# EAGLE design base (1) (EAGLE 8.6.1)
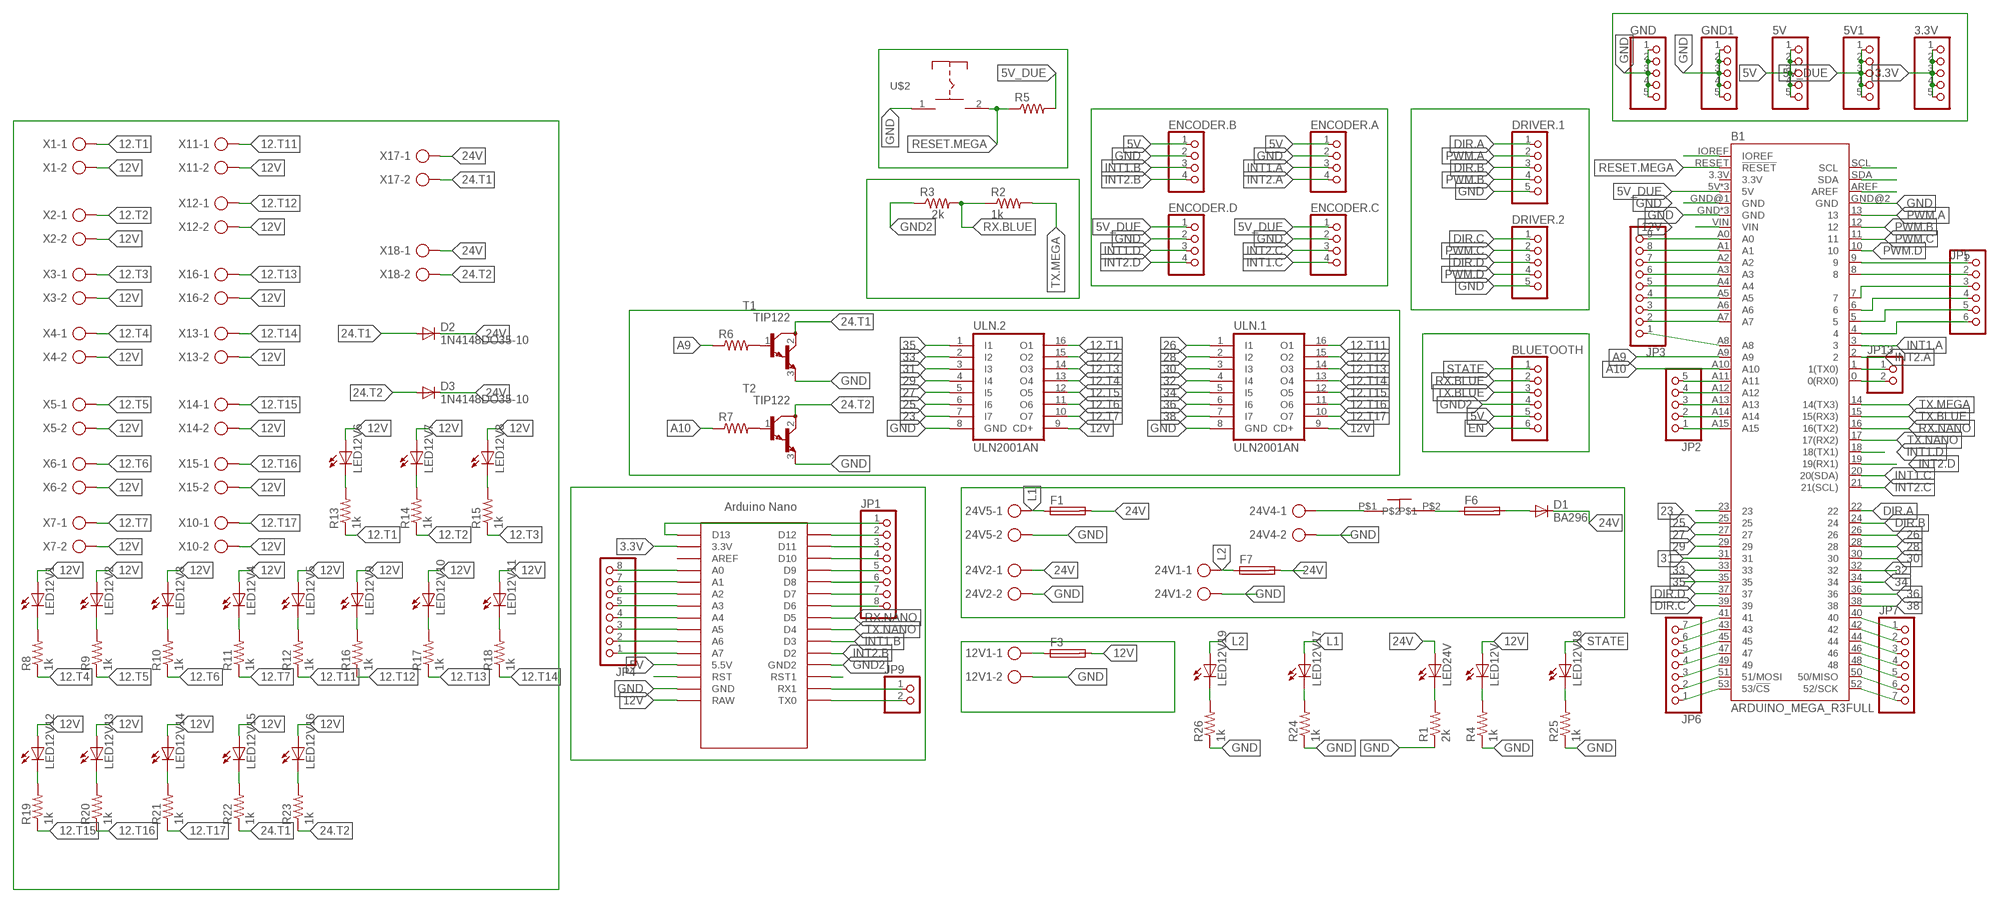
[diagram p0: schematic, sheet 1]

## Parts
3.3V  PINHD-1X5  [1X05]
5V  PINHD-1X5  [1X05]
5V1  PINHD-1X5  [1X05]
12V1  AK300/2  [AK300/2]
24V1  AK300/2  [AK300/2]
24V2  AK300/2  [AK300/2]
24V4  W237-113  [W237-113]
24V5  AK300/2  [AK300/2]
B1  ARDUINO_MEGA_R3FULL  [ARDUINO_MEGA_NO_SILK]
BLUETOOTH  PINHD-1X6  [1X06]
D1  BA296  [P2-15]
D2  1N4148DO35-10  [DO35-10]
D3  1N4148DO35-10  [DO35-10]
DRIVER.1  PINHD-1X5  [1X05]
DRIVER.2  PINHD-1X5  [1X05]
ENCODER.A  PINHD-1X4  [1X04]
ENCODER.B  PINHD-1X4  [1X04]
ENCODER.C  PINHD-1X4  [1X04]
ENCODER.D  PINHD-1X4  [1X04]
F1  SH22,5A  [SH22,5A]
F3  SH22,5A  [SH22,5A]
F6  SH22,5A  [SH22,5A]
F7  SH22,5A  [SH22,5A]
GND  PINHD-1X5  [1X05]
GND1  PINHD-1X5  [1X05]
JP1  PINHD-1X8  [1X08]
JP2  PINHD-1X5  [1X05]
JP3  PINHD-1X9  [1X09]
JP4  PINHD-1X8  [1X08]
JP5  PINHD-1X6  [1X06]
JP6  PINHD-1X7  [1X07]
JP7  PINHD-1X7  [1X07]
JP9  PINHD-1X2  [1X02]
JP13  PINHD-1X2  [1X02]
LED12V  LED5MM  [LED5MM]
LED12V1  LED3MM  [LED3MM]
LED12V2  LED3MM  [LED3MM]
LED12V3  LED3MM  [LED3MM]
LED12V4  LED3MM  [LED3MM]
LED12V5  LED3MM  [LED3MM]
LED12V6  LED3MM  [LED3MM]
LED12V7  LED3MM  [LED3MM]
LED12V8  LED3MM  [LED3MM]
LED12V9  LED3MM  [LED3MM]
LED12V10  LED3MM  [LED3MM]
LED12V11  LED3MM  [LED3MM]
LED12V12  LED3MM  [LED3MM]
LED12V13  LED3MM  [LED3MM]
LED12V14  LED3MM  [LED3MM]
LED12V15  LED3MM  [LED3MM]
LED12V16  LED3MM  [LED3MM]
LED12V17  LED3MM  [LED3MM]
LED12V18  LED3MM  [LED3MM]
LED12V19  LED3MM  [LED3MM]
LED24V  LED5MM  [LED5MM]
R1  2k  R-US_0207/10  [0207/10]
R2  1k  R-US_0204/7  [0204/7]
R3  2k  R-US_0207/10  [0207/10]
R4  1k  R-US_0207/10  [0207/10]
R5  R-US_0207/12  [0207/12]
R6  R-US_0204/5  [0204/5]
R7  R-US_0204/5  [0204/5]
R8  1k  R-US_0204/5  [0204/5]
R9  1k  R-US_0204/5  [0204/5]
R10  1k  R-US_0204/5  [0204/5]
R11  1k  R-US_0204/5  [0204/5]
R12  1k  R-US_0204/5  [0204/5]
R13  1k  R-US_0204/5  [0204/5]
R14  1k  R-US_0204/5  [0204/5]
R15  1k  R-US_0204/5  [0204/5]
R16  1k  R-US_0204/5  [0204/5]
R17  1k  R-US_0204/5  [0204/5]
R18  1k  R-US_0204/5  [0204/5]
R19  1k  R-US_0204/5  [0204/5]
R20  1k  R-US_0204/5  [0204/5]
R21  1k  R-US_0204/5  [0204/5]
R22  1k  R-US_0204/5  [0204/5]
R23  1k  R-US_0204/5  [0204/5]
R24  1k  R-US_0204/5  [0204/5]
R25  1k  R-US_0204/5  [0204/5]
R26  1k  R-US_0204/5  [0204/5]
T1  TIP122  [TO220]
T2  TIP122  [TO220]
U$1  NANO  [NANO]
U$2  PUSHBOTTON  [PUSHBOTTON]
U$3  ON_OFF  [ON_OFF]
ULN.1  ULN2001AN  [DIL16]
ULN.2  ULN2001AN  [DIL16]
X1  AK300/2  [AK300/2]
X2  AK300/2  [AK300/2]
X3  AK300/2  [AK300/2]
X4  AK300/2  [AK300/2]
X5  AK300/2  [AK300/2]
X6  AK300/2  [AK300/2]
X7  AK300/2  [AK300/2]
X10  AK300/2  [AK300/2]
X11  AK300/2  [AK300/2]
X12  AK300/2  [AK300/2]
X13  AK300/2  [AK300/2]
X14  AK300/2  [AK300/2]
X15  AK300/2  [AK300/2]
X16  AK300/2  [AK300/2]
X17  AK300/2  [AK300/2]
X18  AK300/2  [AK300/2]

## Nets
3.3V: 3.3V.1 3.3V.2 3.3V.3 3.3V.4 3.3V.5 U$1.3.3V
5V: 5V.1 5V.2 5V.3 5V.4 5V.5 BLUETOOTH.5 ENCODER.A.1 ENCODER.B.1 U$1.5V(5.5V)
5V_DUE: 5V1.1 5V1.2 5V1.3 5V1.4 5V1.5 B1.5V B1.5V@1(5V) B1.5V@2(5V) ENCODER.C.1 ENCODER.D.1 R5.2
12.T1: R13.1 ULN.2.16(O1) X1.1
12.T2: R14.1 ULN.2.15(O2) X2.1
12.T3: R15.1 ULN.2.14(O3) X3.1
12.T4: R8.1 ULN.2.13(O4) X4.1
12.T5: R9.1 ULN.2.12(O5) X5.1
12.T6: R10.1 ULN.2.11(O6) X6.1
12.T7: R11.1 ULN.2.10(O7) X7.1
12.T11: R12.1 ULN.1.16(O1) X11.1
12.T12: R16.1 ULN.1.15(O2) X12.1
12.T13: R17.1 ULN.1.14(O3) X16.1
12.T14: R18.1 ULN.1.13(O4) X13.1
12.T15: R19.1 ULN.1.12(O5) X14.1
12.T16: R20.1 ULN.1.11(O6) X15.1
12.T17: R21.1 ULN.1.10(O7) X10.1
12V: B1.VIN F3.2 LED12V1.A LED12V2.A LED12V3.A LED12V4.A LED12V5.A LED12V6.A LED12V7.A LED12V8.A LED12V9.A LED12V10.A LED12V11.A LED12V12.A LED12V13.A LED12V14.A LED12V15.A LED12V16.A LED12V.A U$1.RAW ULN.1.9(CD+) ULN.2.9(CD+) X1.2 X2.2 X3.2 X4.2 X5.2 X6.2 X7.2 X10.2 X11.2 X12.2 X13.2 X14.2 X15.2 X16.2
23: B1.23 ULN.2.7(I7)
24.T1: D2.A R22.1 T1.2(C) X17.2
24.T2: D3.A R23.1 T2.2(C) X18.2
24V: 24V2.1 D1.C D2.C D3.C F1.2 F7.2 LED24V.A X17.1 X18.1
25: B1.25 ULN.2.6(I6)
26: B1.26 ULN.1.1(I1)
27: B1.27 ULN.2.5(I5)
28: B1.28 ULN.1.2(I2)
29: B1.29 ULN.2.4(I4)
30: B1.30 ULN.1.3(I3)
31: B1.31 ULN.2.3(I3)
32: B1.32 ULN.1.4(I4)
33: B1.33 ULN.2.2(I2)
34: B1.34 ULN.1.5(I5)
35: B1.35 ULN.2.1(I1)
36: B1.36 ULN.1.6(I6)
38: B1.38 ULN.1.7(I7)
40: B1.40 JP7.1
A9: B1.A9 R6.1
A10: B1.A10 R7.1
DIR.A: B1.22 DRIVER.1.1
DIR.B: B1.24 DRIVER.1.3
DIR.C: B1.39 DRIVER.2.1
DIR.D: B1.37 DRIVER.2.3
EN: BLUETOOTH.6
GND: 12V1.2 24V1.2 24V2.2 24V4.2 24V5.2 B1.GND B1.GND@1(GND) B1.GND@2(GND) B1.GND@3(GND) B1.GND@4(GND) DRIVER.1.5 DRIVER.2.5 ENCODER.A.2 ENCODER.B.2 ENCODER.C.2 ENCODER.D.2 GND1.1 GND1.2 GND1.3 GND1.4 GND1.5 GND.1 GND.2 GND.3 GND.4 GND.5 R1.1 R4.1 R24.1 R25.1 R26.1 T1.3(E) T2.3(E) U$1.GND U$2.1 ULN.1.8(GND) ULN.2.8(GND)
GND2: BLUETOOTH.4 R3.1 U$1.GND1(GND2)
INT1.A: B1.3 ENCODER.A.3
INT1.B: ENCODER.B.3 U$1.D3
INT1.C: B1.20(20(SDA)) ENCODER.C.4
INT1.D: B1.18(18(TX1)) ENCODER.D.3
INT2.A: B1.2 ENCODER.A.4
INT2.B: ENCODER.B.4 U$1.D2
INT2.C: B1.21(21(SCL)) ENCODER.C.3
INT2.D: B1.19(19(RX1)) ENCODER.D.4
L1: 24V5.1 F1.1 LED12V17.A
L2: 24V1.1 F7.1 LED12V19.A
N$1: B1.SCL
N$2: B1.SDA
N$3: B1.AREF
N$7: 24V4.1 U$3.P$1
N$8: F6.1 U$3.P$2
N$9: B1.9 JP5.1
N$10: B1.8 JP5.2
N$11: B1.7 JP5.3
N$12: B1.6 JP5.4
N$13: B1.5 JP5.5
N$14: B1.4 JP5.6
N$16: LED12V1.K(C) R8.2
N$17: B1.1(1(TX0)) JP13.1
N$18: B1.0(0(RX0)) JP13.2
N$21: LED12V18.K(C) R25.2
N$22: LED12V19.K(C) R26.2
N$23: LED24V.K(C) R1.2
N$24: LED12V.K(C) R4.2
N$25: D1.A F6.2
N$27: LED12V2.K(C) R9.2
N$29: LED12V3.K(C) R10.2
N$30: LED12V4.K(C) R11.2
N$31: LED12V5.K(C) R12.2
N$32: LED12V6.K(C) R13.2
N$33: LED12V7.K(C) R14.2
N$34: LED12V8.K(C) R15.2
N$35: LED12V9.K(C) R16.2
N$36: LED12V10.K(C) R17.2
N$37: B1.42 JP7.2
N$38: B1.44 JP7.3
N$39: B1.46 JP7.4
N$40: B1.48 JP7.5
N$41: B1.50(50/MISO) JP7.6
N$42: B1.52(52/SCK) JP7.7
N$43: B1.IOREF
N$44: LED12V11.K(C) R18.2
N$46: LED12V12.K(C) R19.2
N$47: B1.A15 JP2.1
N$48: B1.A14 JP2.2
N$49: B1.A13 JP2.3
N$50: B1.A0 JP3.9
N$51: B1.A1 JP3.8
N$52: B1.A2 JP3.7
N$53: B1.A3 JP3.6
N$54: B1.A4 JP3.5
N$55: B1.A5 JP3.4
N$56: B1.A6 JP3.3
N$57: B1.A7 JP3.2
N$58: B1.A8 JP3.1
N$59: B1.A12 JP2.4
N$60: B1.A11 JP2.5
N$61: LED12V13.K(C) R20.2
N$62: LED12V14.K(C) R21.2
N$63: LED12V15.K(C) R22.2
N$64: LED12V16.K(C) R23.2
N$65: LED12V17.K(C) R24.2
N$75: B1.41 JP6.7
N$76: B1.45 JP6.5
N$77: B1.43 JP6.6
N$78: B1.47 JP6.4
N$79: B1.49 JP6.3
N$80: B1.51(51/MOSI) JP6.2
N$81: B1.53(53/!CS) JP6.1
N$102: R6.2 T1.1(B)
N$103: R7.2 T2.1(B)
N$107: JP1.1 U$1.D13
N$110: JP4.8 U$1.A0
N$111: JP4.7 U$1.A1
N$112: JP4.6 U$1.A2
N$113: JP4.5 U$1.A3
N$114: JP4.4 U$1.A4
N$115: JP4.3 U$1.A5
N$116: JP4.2 U$1.A6
N$117: JP4.1 U$1.A7
N$119: U$1.RST
N$122: JP1.2 U$1.D12
N$123: JP1.3 U$1.D11
N$124: JP1.4 U$1.D10
N$125: JP1.5 U$1.D9
N$126: JP1.6 U$1.D8
N$127: JP1.7 U$1.D7
N$128: JP1.8 U$1.D6
N$134: U$1.RST1
N$135: JP9.1 U$1.RX1
N$136: JP9.2 U$1.TX0
N$152: 12V1.1 F3.1
PWM.A: B1.13 DRIVER.1.2
PWM.B: B1.12 DRIVER.1.4
PWM.C: B1.11 DRIVER.2.2
PWM.D: B1.10 DRIVER.2.4
RESET.MEGA: B1.RESET(!RESET) R5.1 U$2.2
RX.BLUE: BLUETOOTH.2 R2.1 R3.2
RX.NANO: B1.16(16(TX2)) U$1.D5
STATE: BLUETOOTH.1 LED12V18.A
TX.BLUE: B1.15(15(RX3)) BLUETOOTH.3
TX.MEGA: B1.14(14(TX3)) R2.2
TX.NANO: B1.17(17(RX2)) U$1.D4
Unconnected: B1.3.3V U$1.AREF

## Library data of the parts
3.3V 5V 5V1 DRIVER.1 DRIVER.2 GND GND1 JP2 = pinhead:PINHD-1X5: PIN HEADER
12V1 24V1 24V2 24V5 X1-X7 X10-X18 = con-ptr500:AK300/2: CONNECTOR; OC_FARNELL: unknown; OC_NEWARK: unknown
24V4 = con-wago-500:W237-113: WAGO SCREW CLAMP; OC_FARNELL: unknown; OC_NEWARK: unknown
B1 = SparkFun-Boards:ARDUINO_MEGA_R3: Arduino Mega R3 ATmega2560 R3 compatible footprint. SparkFun Products: Arduino Mega 2560 R3 <https://www.sparkfun.com/products/11061>
BLUETOOTH JP5 = pinhead:PINHD-1X6: PIN HEADER
D1 = diode:BA296: DIODE
D2 D3 = diode:1N4148: DIODE high speed (Philips)
ENCODER.A ENCODER.B ENCODER.C ENCODER.D = pinhead:PINHD-1X4: PIN HEADER
F1 F3 F6 F7 = fuse:SH22,5A: FUSE HOLDER grid 22,5mm, isolated cap OGN0031 8201, Schurter (Buerklin); MPN: 0031.7701.11; OC_FARNELL: unknown; OC_NEWARK: 04F1224
JP1 JP4 = pinhead:PINHD-1X8: PIN HEADER
JP3 = pinhead:PINHD-1X9: PIN HEADER
JP6 JP7 = pinhead:PINHD-1X7: PIN HEADER
JP9 JP13 = pinhead:PINHD-1X2: PIN HEADER
LED12V LED12V1-LED12V19 LED24V = led:LED: LED OSRAM: - CHIPLED LG R971, LG N971, LY N971, LG Q971, LY Q971, LO R971, LY R971 LH N974, LH R974 LS Q976, LO Q976, LY Q976 LO Q996 - Hyper CHIPLED LW Q18S LB Q993, LB Q99A, LB R99A - SideLED LS A670, LO A670, LY A670, LG A670, LP A670 LB A673, LV A673, LT A673, LW A673 LH A674 LY A675 LS A676, LA A676, LO A676, LY A676, LW A676 LS A679, LY A679, LG A679 - Hyper Micro SIDELED® LS Y876, LA Y876, LO Y876, LY Y876 LT Y87S - SmartLED LW L88C, LW L88S LB L89C, LB L89S, LG L890 LS L89K, LO L89K, LY L89K LS L896, LA L896, LO L896, LY L896 - TOPLED LS T670, LO T670, LY T670, LG T670, LP T670 LSG T670, LSP T670, LSY T670, LOP T670, LYG T670 LG T671, LOG T671, LSG T671 LB T673, LV T673, LT T673, LW T673 LH T674 LS T676, LA T676, LO T676, LY T676, LB T676, LH T676, LSB T676, LW T676 LB T67C, LV T67C, LT T67C, LS T67K, LO T67K, LY T67K, LW E67C LS E67B, LA E67B, LO E67B, LY E67B, LB E67C, LV E67C, LT E67C LW T67C LS T679, LY T679, LG T679 LS T770, LO T770, LY T770, LG T770, LP T770 LB T773, LV T773, LT T773, LW T773 LH T774 LS E675, LA E675, LY E675, LS T675 LS T776, LA T776, LO T776, LY T776, LB T776 LHGB T686 LT T68C, LB T68C - Hyper Mini TOPLED® LB M676 - Mini TOPLED Santana® LG M470 LS M47K, LO M47K, LY M47K Source: http://www.osram.convergy.de LUXEON: - LUMILED® LXK2-PW12-R00, LXK2-PW12-S00, LXK2-PW14-U00, LXK2-PW14-V00 LXK2-PM12-R00, LXK2-PM12-S00, LXK2-PM14-U00 LXK2-PE12-Q00, LXK2-PE12-R00, LXK2-PE12-S00, LXK2-PE14-T00, LXK2-PE14-U00 LXK2-PB12-K00, LXK2-PB12-L00, LXK2-PB12-M00, LXK2-PB14-N00, LXK2-PB14-P00, LXK2-PB14-Q00 LXK2-PR12-L00, LXK2-PR12-M00, LXK2-PR14-Q00, LXK2-PR14-R00 LXK2-PD12-Q00, LXK2-PD12-R00, LXK2-PD12-S00 LXK2-PH12-R00, LXK2-PH12-S00 LXK2-PL12-P00, LXK2-PL12-Q00, LXK2-PL12-R00 Source: www.luxeon.com KINGBRIGHT: KA-3528ASYC Source: www.kingbright.com
R1-R26 = rcl:R-US_: RESISTOR, American symbol; SPICEPREFIX: R
T1 T2 = transistor:TIP122: NPN BIPOLAR DARLINGTON TRANSISTOR
U$1 = Arduino-clone:NANO: Arduino Nano
U$2 = push botton:PUSHBOTTON
U$3 = ON_OFF:ON_OFF
ULN.1 ULN.2 = uln-udn:ULN2001A: DRIVER ARRAY

## Board
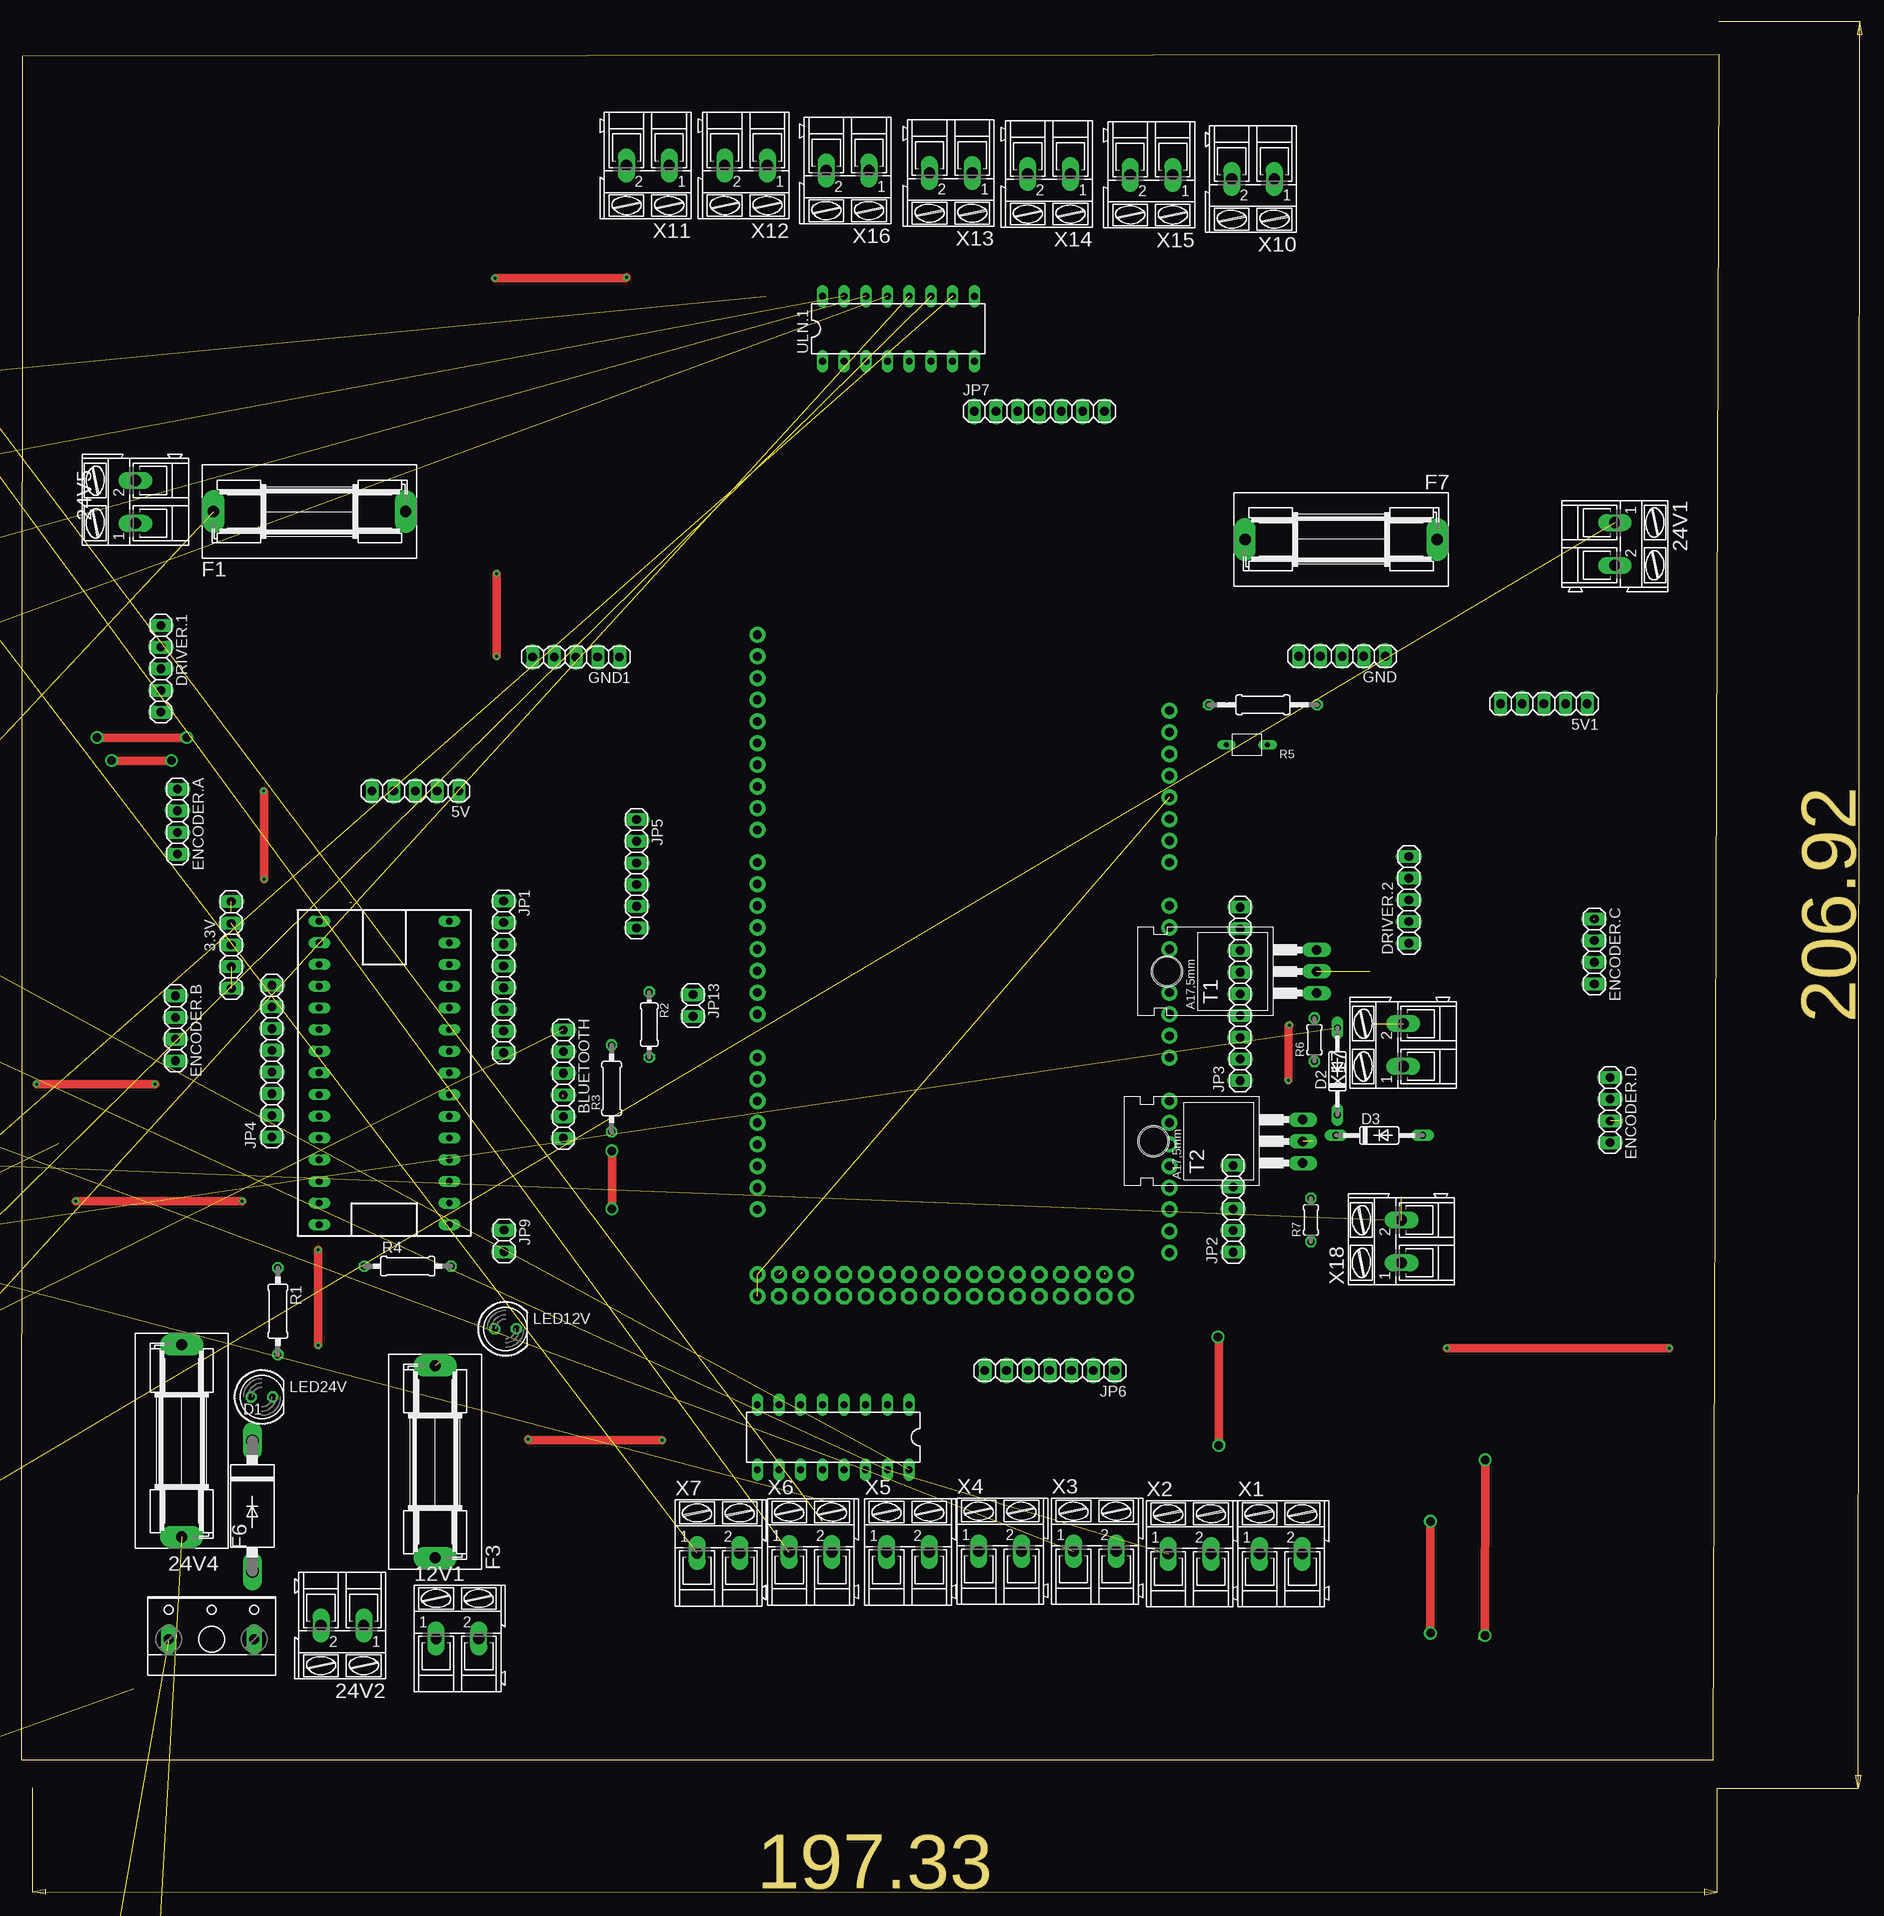
[diagram p1: board, top side]
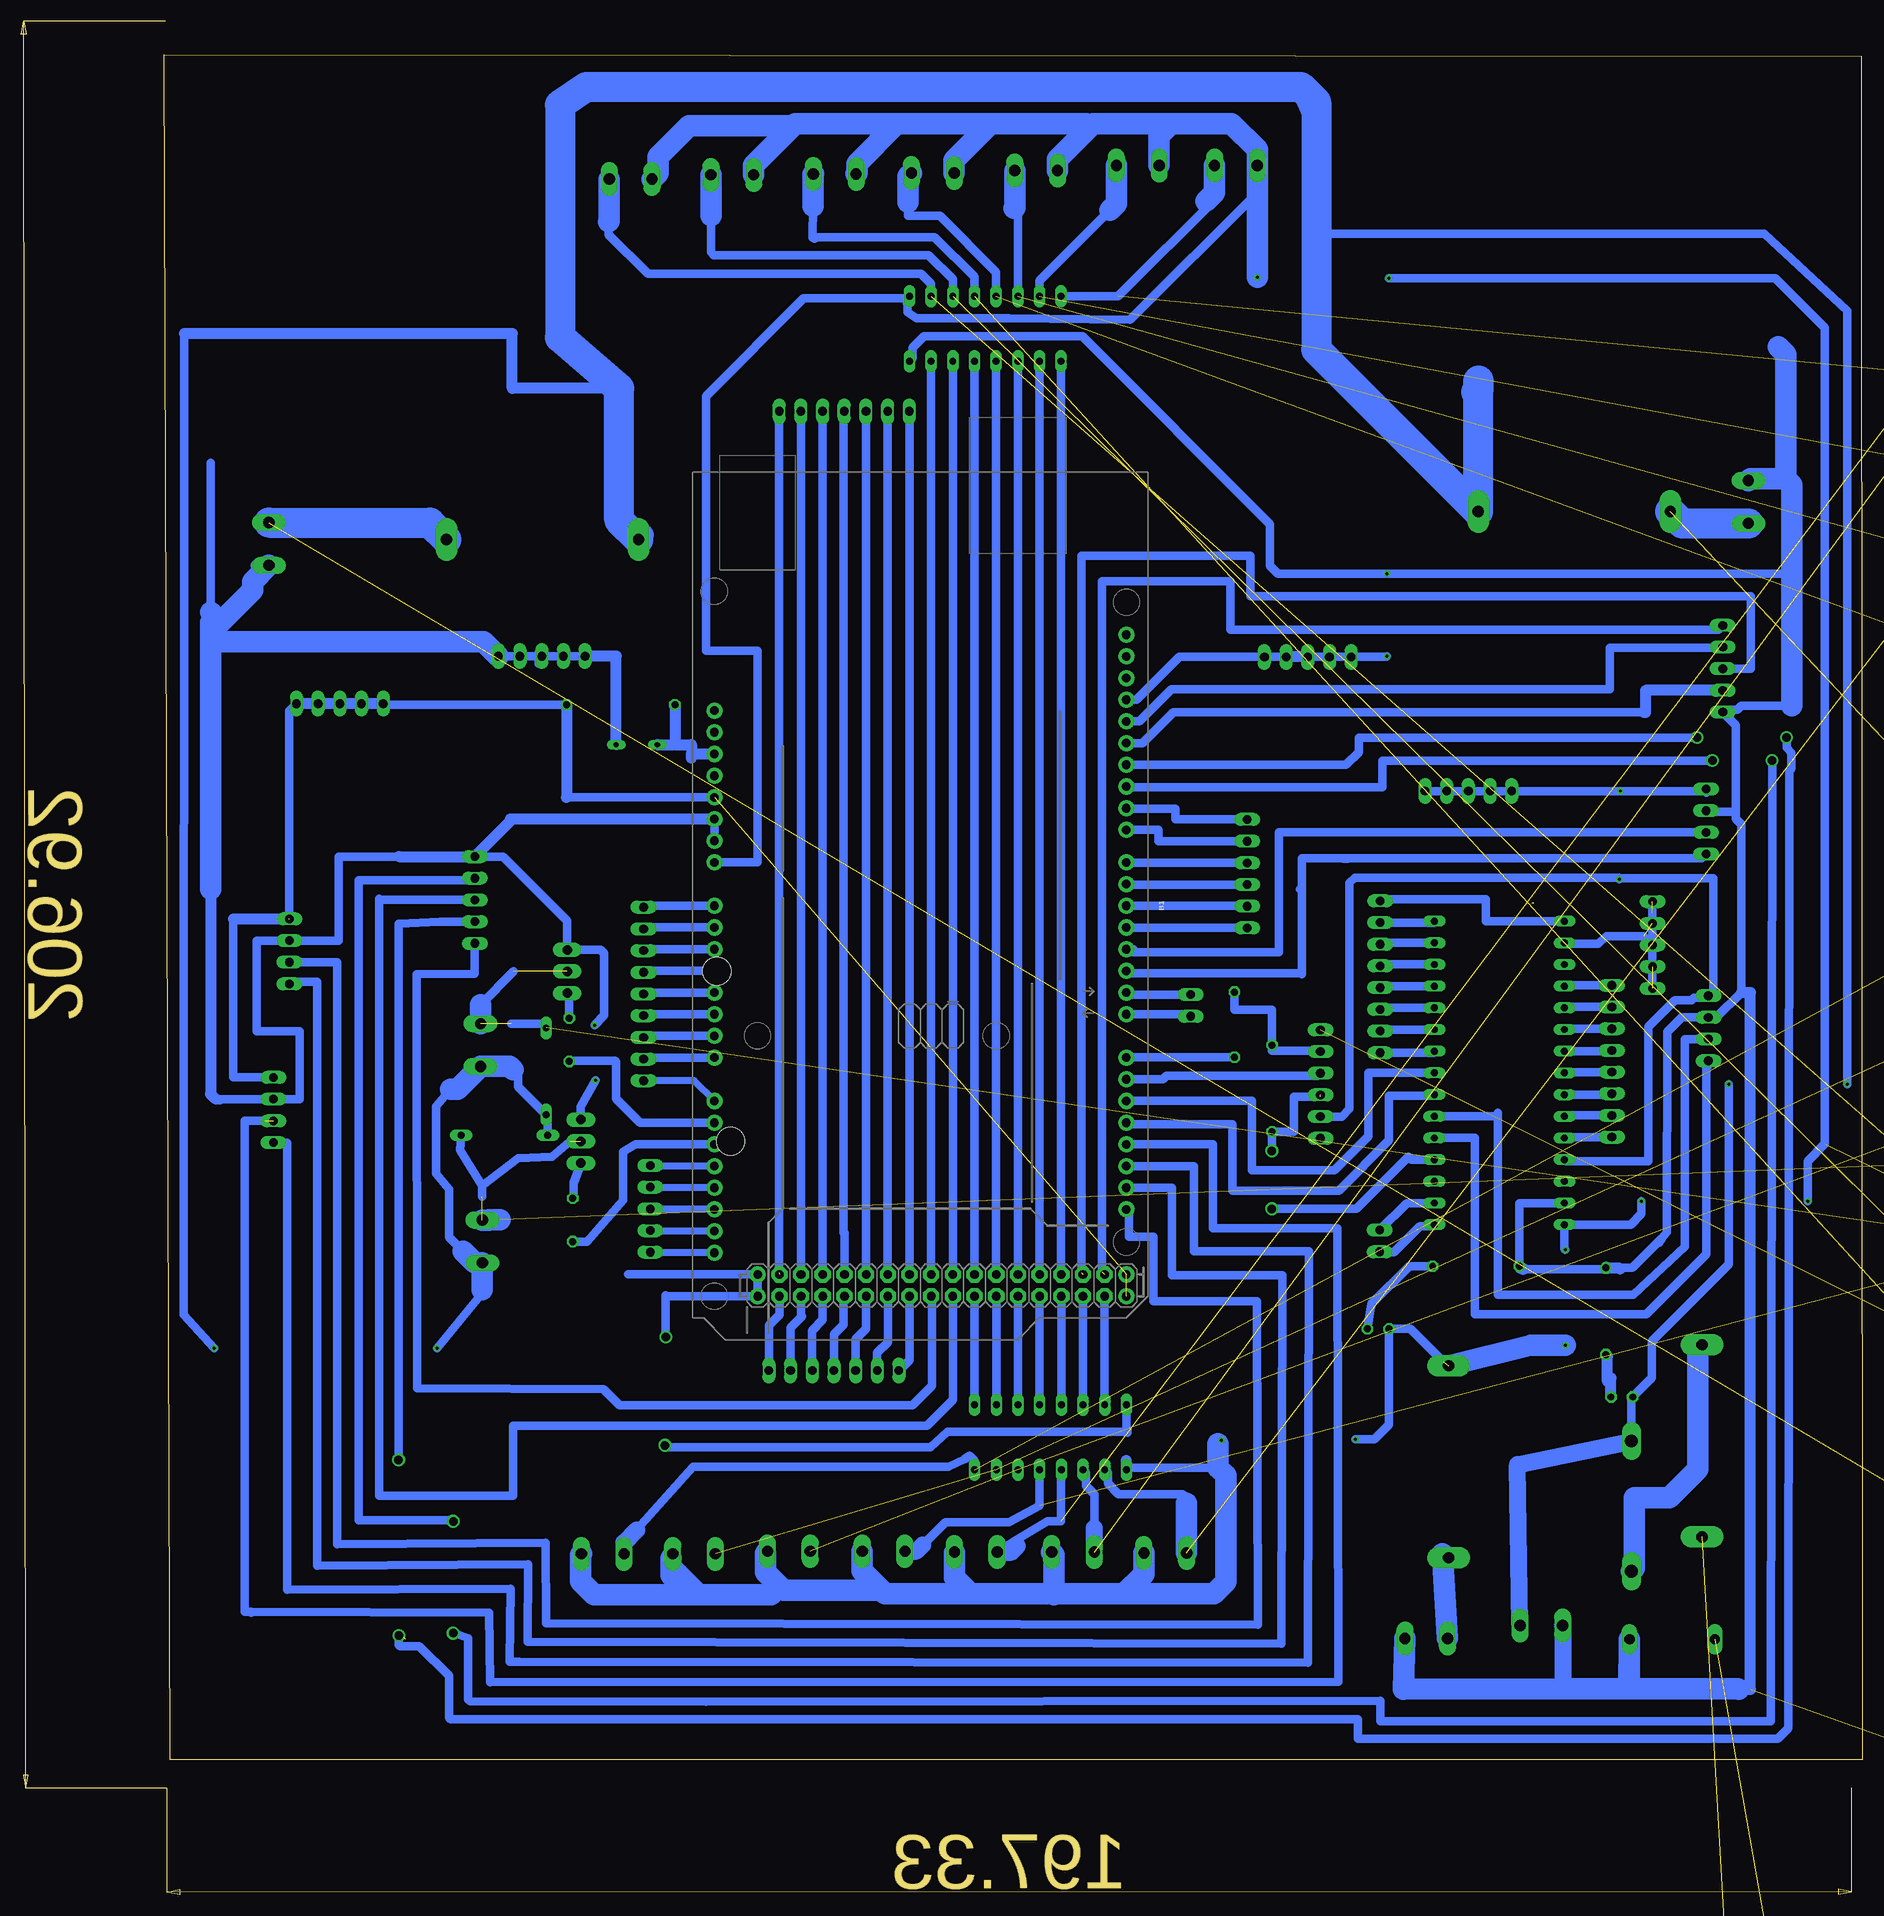
[diagram p2: board, bottom side, seen from below]

Size 198.94 x 199.72 mm. Coordinates in mm from the lower left corner, seen from the top.
Outline: 0,0.02 198.23,0 198.94,199.72 0.11,199.51 0,0.02
Copper layers (1*16): Top 0.035mm / dielectric 1.5mm / Bottom 0.035mm
Design rules "default *": minimum track width 6mil, minimum drill 0.35mm, track to track 40mil, track to pad 40mil, pad to pad 6mil, via to via 6mil, smd to smd 6mil, copper to edge 40mil, drill to drill 6mil, minimum pad ring 10mil, minimum via ring 8mil, stop-mask expansion 4mil, vias tented up to drill 0mil, thermal gap 10mil

### Footprints (pad centres in the part's own frame; a part is rotated, then mirrored left to right if it is on the bottom)
1X05 = drill 1.016 long: 1 -5.08,0; 2 -2.54,0; 3 0,0; 4 2.54,0; 5 5.08,0
AK300/2 = drill 1.321 long: 1 -2.515,0; 2 2.489,0
W237-113 = drill 1.194 long: 1 -5,-1.27; 2 5,-1.27
ARDUINO_MEGA_NO_SILK = drill 1.016 pad 1.88: 0 13.97,24.13; 1 11.43,24.13; 2 8.89,24.13; 3 6.35,24.13; 3.3V -13.97,-24.13; 4 3.81,24.13; 5 1.27,24.13; 5V -11.43,-24.13; 5V@1 44.45,24.13; 5V@2 46.99,24.13; 6 -1.27,24.13; 7 -3.81,24.13; 8 -7.62,24.13; 9 -10.16,24.13; 10 -12.7,24.13; 11 -15.24,24.13; 12 -17.78,24.13; 13 -20.32,24.13; 14 19.05,24.13; 15 21.59,24.13; 16 24.13,24.13; 17 26.67,24.13; 18 29.21,24.13; 19 31.75,24.13; 20 34.29,24.13; 21 36.83,24.13; A0 1.27,-24.13; A1 3.81,-24.13; A2 6.35,-24.13; A3 8.89,-24.13; A4 11.43,-24.13; A5 13.97,-24.13; A6 16.51,-24.13; A7 19.05,-24.13; A8 24.13,-24.13; A9 26.67,-24.13; A10 29.21,-24.13; A11 31.75,-24.13; A12 34.29,-24.13; A13 36.83,-24.13; A14 39.37,-24.13; A15 41.91,-24.13; AREF -25.4,24.13; GND -8.89,-24.13; GND@1 -6.35,-24.13; GND@2 44.45,-19.05; GND@3 46.99,-19.05; GND@4 -22.86,24.13; IOREF -19.05,-24.13; NC -21.59,-24.13; RESET -16.51,-24.13; SCL -30.48,24.13; SDA -27.94,24.13; VIN -3.81,-24.13 | drill 1.016 pad 1.88 octagon: 22 44.45,21.59; 23 46.99,21.59; 24 44.45,19.05; 25 46.99,19.05; 26 44.45,16.51; 27 46.99,16.51; 28 44.45,13.97; 29 46.99,13.97; 30 44.45,11.43; 31 46.99,11.43; 32 44.45,8.89; 33 46.99,8.89; 34 44.45,6.35; 35 46.99,6.35; 36 44.45,3.81; 37 46.99,3.81; 38 44.45,1.27; 39 46.99,1.27; 40 44.45,-1.27; 41 46.99,-1.27; 42 44.45,-3.81; 43 46.99,-3.81; 44 44.45,-6.35; 45 46.99,-6.35; 46 44.45,-8.89; 47 46.99,-8.89; 48 44.45,-11.43; 49 46.99,-11.43; 50 44.45,-13.97; 51 46.99,-13.97; 52 44.45,-16.51; 53 46.99,-16.51
1X06 = drill 1.016 long: 1 -6.35,0; 2 -3.81,0; 3 -1.27,0; 4 1.27,0; 5 3.81,0; 6 6.35,0
P2-15 = drill 1.499 long: A 7.62,0; C -7.62,0
DO35-10 = drill 0.813 long: A 5.08,0; C -5.08,0
1X04 = drill 1.016 long: 1 -3.81,0; 2 -1.27,0; 3 1.27,0; 4 3.81,0
SH22,5A = drill 1.321 pad 2.54 long: 1 -11.252,0; 2 11.252,0
1X08 = drill 1.016 long: 1 -8.89,0; 2 -6.35,0; 3 -3.81,0; 4 -1.27,0; 5 1.27,0; 6 3.81,0; 7 6.35,0; 8 8.89,0
1X09 = drill 1.016 long: 1 -10.16,0; 2 -7.62,0; 3 -5.08,0; 4 -2.54,0; 5 0,0; 6 2.54,0; 7 5.08,0; 8 7.62,0; 9 10.16,0
1X07 = drill 1.016 long: 1 -7.62,0; 2 -5.08,0; 3 -2.54,0; 4 0,0; 5 2.54,0; 6 5.08,0; 7 7.62,0
1X02 = drill 1.016 long: 1 -1.27,0; 2 1.27,0
LED5MM = drill 0.813 octagon: A -1.27,0; K 1.27,0
LED3MM = drill 0.813 octagon: A -1.27,0; K 1.27,0
0207/10 = drill 0.813 octagon: 1 -5.08,0; 2 5.08,0
0204/7 = drill 0.813 octagon: 1 -3.81,0; 2 3.81,0
0207/12 = drill 0.813 octagon: 1 -6.35,0; 2 6.35,0
0204/5 = drill 0.813 octagon: 1 -2.54,0; 2 2.54,0
TO220 = drill 1.118 long: 1 -2.54,-6.35; 2 0,-6.35; 3 2.54,-6.35 | hole 3.302: 0,11.176
NANO = drill 0.8 long: 3.3V -10.16,24.13; 5V -10.16,-1.27; A0 -10.16,19.05; A1 -10.16,16.51; A2 -10.16,13.97; A3 -10.16,11.43; A4 -10.16,8.89; A5 -10.16,6.35; A6 -10.16,3.81; A7 -10.16,1.27; AREF -10.16,21.59; D2 5.08,1.27; D3 5.08,3.81; D4 5.08,6.35; D5 5.08,8.89; D6 5.08,11.43; D7 5.08,13.97; D8 5.08,16.51; D9 5.08,19.05; D10 5.08,21.59; D11 5.08,24.13; D12 5.08,26.67; D13 -10.16,26.67; GND -10.16,-6.35; GND1 5.08,-1.27; RAW -10.16,-8.89; RST -10.16,-3.81; RST1 5.08,-3.81; RX1 5.08,-6.35; TX0 5.08,-8.89
PUSHBOTTON = drill 0.6 long: 1 -12.43,5.08; 2 -7.62,5.08
ON_OFF = drill 1 pad 2.184 long: P$1 2,9; P$2 9.525,8.89
DIL16 = drill 0.813 long: 1 -8.89,-3.81; 2 -6.35,-3.81; 3 -3.81,-3.81; 4 -1.27,-3.81; 5 1.27,-3.81; 6 3.81,-3.81; 7 6.35,-3.81; 8 8.89,-3.81; 9 8.89,3.81; 10 6.35,3.81; 11 3.81,3.81; 12 1.27,3.81; 13 -1.27,3.81; 14 -3.81,3.81; 15 -6.35,3.81; 16 -8.89,3.81

### Placement (x,y rotation side)
3.3V  24.59,95.44 90 top
5V  46.16,113.48 180 top
5V1  178.36,123.7 180 top
12V1  51.1,14.22 0 top
24V1  186.67,142.39 270 top
24V2  37.59,15.74 180 top
24V4  22.28,15.41 0 top
24V5  13.36,147.34 90 top
B1  110.36,101.3 270 bottom
BLUETOOTH  63.49,79.15 270 top
D1  27.06,29.72 270 top
D2  154.18,80.64 90 top
D3  159.08,73.14 0 top
DRIVER.1  16.36,127.8 270 top
DRIVER.2  162.54,100.72 90 top
ENCODER.A  18.3,109.9 270 top
ENCODER.B  18.05,85.69 270 top
ENCODER.C  184.27,94.69 270 top
ENCODER.D  186.12,76.12 270 top
F1  33.76,146.21 0 top
F3  48.48,34.93 90 top
F6  18.79,37.37 90 top
F7  154.62,142.94 180 top
GND  154.71,129.26 180 top
GND1  64.97,129.18 180 top
JP1  56.5,91.71 270 top
JP2  141.98,64.54 90 top
JP3  142.78,89.71 90 top
JP4  29.35,81.83 90 top
JP5  72.08,103.79 270 top
JP6  120.49,45.59 180 top
JP7  119.27,157.94 0 top
JP9  56.55,60.78 270 top
JP13  78.68,88.36 270 top
LED12V  56.72,50.49 0 top
LED12V1  -50.79,44.44 0 top  (outside the outline)
LED12V2  -69.49,235.14 0 top  (outside the outline)
LED12V3  -69.49,222.44 0 top  (outside the outline)
LED12V4  -69.49,209.74 0 top  (outside the outline)
LED12V5  -69.49,197.04 0 top  (outside the outline)
LED12V6  -69.49,82.74 0 top  (outside the outline)
LED12V7  -69.49,70.04 0 top  (outside the outline)
LED12V8  -66.79,56.84 0 top  (outside the outline)
LED12V9  -69.49,184.34 0 top  (outside the outline)
LED12V10  -69.49,171.64 0 top  (outside the outline)
LED12V11  -69.49,158.94 0 top  (outside the outline)
LED12V12  -69.49,146.24 0 top  (outside the outline)
LED12V13  -69.49,133.54 0 top  (outside the outline)
LED12V14  -69.49,120.84 0 top  (outside the outline)
LED12V15  -69.49,108.14 0 top  (outside the outline)
LED12V16  -69.49,95.44 0 top  (outside the outline)
LED12V17  -72.02,44.04 0 top  (outside the outline)
LED12V18  -72.02,17.44 0 top  (outside the outline)
LED12V19  -72.02,-9.16 0 top  (outside the outline)
LED24V  28.18,42.51 0 top
R1  30.05,52.55 270 top
R2  73.56,86.11 270 top
R3  69.15,78.64 90 top
R4  45.26,57.83 0 top
R5  145.45,123.58 0 top
R6  151.48,84.34 90 top
R7  151.08,63.24 90 top
R8  -37.96,65.84 0 top  (outside the outline)
R9  -31.56,197.84 0 top  (outside the outline)
R10  -30.88,185.44 0 bottom  (outside the outline)
R11  -31.56,172.44 0 top  (outside the outline)
R12  -31.56,159.74 0 top  (outside the outline)
R13  -31.56,108.94 0 top  (outside the outline)
R14  -31.56,96.24 0 top  (outside the outline)
R15  -31.56,83.54 0 top  (outside the outline)
R16  -31.56,147.04 0 top  (outside the outline)
R17  -31.56,134.34 0 top  (outside the outline)
R18  -31.56,121.64 0 top  (outside the outline)
R19  -31.56,20.04 0 top  (outside the outline)
R20  -31.56,32.74 0 top  (outside the outline)
R21  -31.56,45.44 0 top  (outside the outline)
R22  -31.56,58.14 0 top  (outside the outline)
R23  -31.56,70.84 0 top  (outside the outline)
R24  -70.72,30.74 0 top  (outside the outline)
R25  -70.72,4.14 0 top  (outside the outline)
R26  -70.72,-22.46 0 top  (outside the outline)
T1  145.38,92.34 90 top
T2  143.78,72.44 90 top
U$1  45.06,71.57 0 top
U$2  133.55,123.98 180 top
U$3  5.38,-51.26 0 top  (outside the outline)
ULN.1  102.75,167.62 0 top
ULN.2  95.11,37.79 180 top
X1  147.58,24.14 0 top
X2  136.88,24.14 0 top
X3  125.78,24.44 0 top
X4  114.68,24.44 0 top
X5  103.88,24.34 0 top
X6  92.48,24.34 0 top
X7  81.68,24.24 0 top
X10  144.28,185.14 180 top
X11  73.38,186.74 180 top
X12  84.88,186.74 180 top
X13  108.88,185.84 180 top
X14  120.38,185.74 180 top
X15  132.38,185.64 180 top
X16  96.78,186.14 180 top
X17  161.88,83.74 90 top
X18  161.68,60.74 90 top

### Tracks (layer width: path | path; a pad name or v marks a point on that pad's centre or on a via)
3.3V  (3 unrouted)
  Bottom 1.016: 24.59,99.25 3.3V.1 | 3.3V.3 25.62,96.47 30.01,96.47 30.91,95.57 34.77,95.57 U$1.3.3V | 3.3V.4 3.3V.5
5V  (via drill 0.35)
  Top 1.016: v28.48,103.14 28.48,113.38 v28.38,113.48
  Bottom 1: 18.3,113.25 ENCODER.A.1 | 63.49,75.32 BLUETOOTH.5
  Bottom 1.016: 5V.5 40.85,113.71 | 5V.5 5V.4 5V.3 5V.2 5V.1 | 5V.5 41.08,112.5 | U$1.5V 34.74,70.14 25.08,70.14 25.08,85.87 21.95,89 20.01,89 19.75,89.25 18.3,89.25 ENCODER.B.1 17.48,90.07 17.48,103.25 28.37,103.25 | 5V.5 v28.38,113.48 18.53,113.48 ENCODER.A.1 | 28.37,103.25 v28.48,103.14 | BLUETOOTH.5 60.98,75.34 60.08,76.24 60.08,102.74 59.48,103.34 28.47,103.34 28.37,103.25
5V_DUE  (3 unrouted)
  Bottom 1: 190.84,98.48 190.84,79.93 ENCODER.D.1
  Bottom 1.016: 151.8,112.73 B1.5V | R5.2 173.15,123.58 5V1.5 | ENCODER.C.1 184.27,122.88 5V1.1
  Bottom 1.27: 5V1.5 5V1.4 5V1.3 5V1.2 5V1.1 | R5.2 151.8,112.73 | 184.29,98.48 190.84,98.48
12.T1  (1 unrouted)
  Bottom 1.016: ULN.2.16 104,35.06 104.58,35.64 105.18,35.24 107.08,34.34 136.98,34.34 143.57,26.94
  Bottom 2: X1.1 145.06,25.44 143.57,26.94
12.T2  (2 unrouted)
12.T3  (2 unrouted)
12.T4  (1 unrouted)
  Bottom 1.016: ULN.2.13 96.38,29.74 99.97,27.85 107.41,27.85 110.09,25.16
  Bottom 2: X4.1 110.81,24.44 110.09,25.16
12.T5  (1 unrouted)
  Bottom 1: X5.1 99.28,25.64 95.48,27.94 93.88,27.94 93.88,33.94 ULN.2.12
  Bottom 2: X5.1 99.68,24.34 98.98,25.04
12.T6  (1 unrouted)
  Bottom 1.016: 89.96,27.14 89.96,31.11 90.94,32.08 90.94,33.63 ULN.2.11
  Bottom 2: X6.1 89.96,27.14
12.T7  (1 unrouted)
  Bottom 1.016: 79.16,30.04 79.16,30.63 79.67,31.14 87.12,31.14 88.4,32.42 88.4,33.63 ULN.2.10
  Bottom 2.5: X7.1 79.16,30.04
12.T11  (1 unrouted)
  Bottom 1.016: ULN.1.16 87.19,171.43 75.58,183.04 75.58,186.43 X11.1
  Bottom 2.5: X11.1 75.89,183.53 76.88,182.54
12.T12  (1 unrouted)
  Bottom 1.016: ULN.1.15 96.4,173.22 88.13,181.49 87.48,182.14 87.48,187.04 87.18,187.34 | 87.08,187.44 87.18,187.34 | 87.18,187.34 87.48,187.34 87.48,186.83 X12.1
  Bottom 2.5: X12.1 87.39,182.23 88.13,181.49
12.T13  (1 unrouted)
  Bottom 1.016: ULN.1.14 98.94,185.79 X16.1
  Bottom 2.5: X16.1 99.29,181.8 99.39,181.7
12.T14  (1 unrouted)
  Bottom 1.016: ULN.1.13 101.48,174.24 108.08,180.84 111.78,180.84 111.78,182.44 111.78,186.54 111.38,186.54 | 111.28,185.24 111.39,185.36 X13.1
  Bottom 2.5: X13.1 111.78,185.46 111.78,182.44
12.T15  (1 unrouted)
  Bottom 1.016: ULN.1.12 104.02,173.68 108.68,178.34 122.58,178.34 122.78,178.14 122.99,178.26 122.94,181.94
  Bottom 2.5: X14.1 122.94,185.69 122.94,181.94
12.T16  (1 unrouted)
  Bottom 1.016: ULN.1.11 106.56,173.42 109.38,176.24 134.58,176.24 134.89,176.56 134.89,180.84
  Bottom 2.5: X15.1 134.89,180.84
12.T17  (1 unrouted)
  Bottom 1.016: ULN.1.10 109.1,172.86 110.28,174.04 142.28,174.04 146.88,178.64 146.88,180.14
  Bottom 2.5: X10.1 146.79,180.23 146.88,180.14
12V  (via drill 0.35)  (17 unrouted)
  Top 1.016: v75.08,37.44 59.48,37.44 v59.38,37.54 | v34.78,48.54 v34.78,59.74 | v25.88,65.44 v6.38,65.44 | v55.48,173.54 70.78,173.54 v70.88,173.64
  Bottom 1: 49.08,46.64 52.92,50.49 LED12V.A 55.45,39.27 57.18,37.54
  Bottom 1.016: 111.91,171.16 ULN.1.9 | 111.91,171.16 124.03,171.16 135.46,159.73 135.46,129.88 129.41,129.88 129.41,105.11 B1.VIN | 86.48,19.44 94.58,19.44 | 94.58,19.44 94.68,19.34 94.97,19.63 X6.2 | 94.58,19.44 95.58,19.44 | 104.48,19.44 104.93,19.89 | 104.93,19.89 106.38,21.34 | 106.38,24.24 106.38,25.04 106.58,25.24 106.58,24.55 X5.2 | 104.93,19.89 114.93,19.89 | 114.93,19.89 116.83,21.79 | 114.93,19.89 125.73,19.89 | 125.73,19.89 128.48,22.64 128.48,24.23 X3.2 | 125.73,19.89 126.38,19.89 127.28,19.89 135.83,19.89 | 135.83,19.89 139.58,23.64 139.37,23.85 X2.2 | 135.83,19.89 149.13,19.89 150.18,20.94 | 73.89,191.64 81.48,191.64 81.48,191.14 | 90.13,191.6 90.88,191.6 | 102.13,191.6 113.73,191.6 | 113.73,191.6 X14.2 | 113.73,191.6 125.43,191.6 126.03,191.4 X15.2 | X11.2 70.89,183.53 85.78,168.64 99.98,168.84 110.78,168.84 111.88,169.52 111.91,171.16 | 75.48,34.24 85.96,34.24 ULN.2.9 | 75.48,37.04 v75.08,37.44 | 57.18,37.54 v59.38,37.54 | v34.78,59.74 34.9,59.87 U$1.RAW 27.14,62.68 25.88,63.94 v25.88,65.44 | v6.38,65.44 6.38,70.14 4.38,72.14 4.38,167.74 10.18,173.54 v55.48,173.54
  Bottom 1.27: ULN.2.9 86.22,35.04
  Bottom 2.5: F3.2 38.82,48.54 v34.78,48.54 | v70.88,173.64 70.88,186.73 X11.2 70.89,188.64 73.89,191.64 80.98,191.64 81.48,191.14 82.39,190.23 X12.2 | 81.48,191.64 81.52,191.6 90.13,191.6 94.29,187.44 X16.2 | 90.88,191.6 102.13,191.6 | 102.13,191.6 106.39,187.34 X13.2 | 102.13,191.6 113.12,191.6 | 113.12,191.6 117.78,186.94 117.78,185.85 X14.2 | 113.12,191.6 125.02,191.6 129.88,186.74 X15.2 | 126.03,191.4 137.42,191.4 141.08,187.74 141.08,185.85 X10.2 | X7.2 84.16,21.75 86.48,19.44 | 86.48,19.44 75.98,19.44 74.58,20.84 74.58,33.34 75.48,34.24 75.48,37.04 | 86.48,19.44 94.78,19.44 94.97,19.63 | 94.68,19.34 94.68,24.05 X6.2 | 95.58,19.44 104.48,19.44 | 104.48,19.44 106.38,21.34 106.38,24.24 | 104.48,19.44 114.48,19.44 116.83,21.79 117.16,22.13 X4.2 | 114.93,19.89 126.38,19.89 128.48,21.99 128.48,24.23 | 127.28,19.89 127.83,19.34 137.28,19.34 | 137.28,19.34 139.58,21.64 139.58,23.64 | 137.28,19.34 148.58,19.34 150.18,20.94 150.18,24.03 X1.2
23
  Bottom 1: B1.23 ULN.2.7
24.T1  (3 unrouted)
  Bottom 1.016: 161.88,88.44 157.98,92.34 | D2.A 154.69,86.23 158.28,86.23
  Bottom 2.5: X17.2 161.88,88.44
24.T2  (3 unrouted)
  Bottom 1.016: D3.A 164.26,71.42 161.68,67.24 | 161.68,65.94 161.68,67.24 | 161.68,67.24 157.48,70.44 153.48,70.64 151.38,72.44
  Bottom 2.5: X18.2 160.89,63.23 160.88,63.24 159.58,63.24
24V  (via drill 0.35)
  Top 1.016: v193.08,48.24 v166.98,48.24 | v15.68,79.14 v1.78,79.14
  Bottom 1.016: 196.58,167.04 196.68,52.14 v193.08,48.24 | D1.C 27.06,42.36 LED24V.A 24.68,44.75 24.68,49.04 15.68,58.04 v15.68,79.14 | v1.78,79.14 1.78,169.74 11.48,178.74 63.88,178.74 63.98,178.84 | D3.C 154,75.04 D2.C 157.48,78.86 157.48,80.84 158.08,80.84 | 163.93,59.59 165.58,61.24 165.58,66.84 167.08,68.64 167.08,76.54 165.38,78.54 | v166.98,48.24 161.68,54.64 161.68,55.04
  Bottom 1.27: 145.62,160.64 158.18,160.64 158.18,167.04 196.58,167.04
  Bottom 2: 24V2.1 40.41,34.6 D1.C
  Bottom 2.5: 161.68,55.04 X18.1 162.56,58.23 163.93,59.59 | 158.08,80.84 158.46,81.23 X17.1 164.56,78.54 165.38,78.54
  Bottom 2.54: F7.2 142.82,143.48 | F1.2 45.25,146.45 45.25,160.2 | 63.98,165.18 63.98,178.84 63.98,191.84 65.78,195.94
  Bottom 3.5: F7.2 145.62,145.2 145.62,160.64 152.58,166.6 152.58,193.84 149.48,195.94 65.78,195.94 63.98,194.14 63.98,165.18 45.25,146.45 | F1.2 45.01,161.51 44.98,161.54 44.98,160.48 45.25,160.2
25
  Bottom 1: B1.25 ULN.2.6
26
  Bottom 1: ULN.1.1 B1.26
27
  Bottom 1: B1.27 ULN.2.5
28
  Bottom 1: ULN.1.2 B1.28
29
  Bottom 1: 96.48,54.31 B1.29 ULN.2.4
30
  Bottom 1: ULN.1.3 B1.30
31
  Bottom 1: B1.31 ULN.2.3
32
  Bottom 1: ULN.1.4 B1.32
33
  Bottom 1: B1.33 ULN.2.2
34
  Bottom 1: ULN.1.5 B1.34
35
  Bottom 1: B1.35 ULN.2.1
36
  Bottom 1: ULN.1.6 B1.36
38
  Bottom 1: ULN.1.7 B1.38
40
  Bottom 1: JP7.1 111.65,56.85 B1.40
A9
  Bottom 1.016: B1.A9 143.21,74.63 146,77.43 146,81.75 146.13,81.88 151.4,81.88 R6.1
A10
  Bottom 1.016: B1.A10 143.73,72.09 145.18,71.24 145.18,65.54 149.42,60.7 R7.1
DIR.A  (1 unrouted)
  Bottom 1: DRIVER.1.1 16.86,132.38 74.03,132.38 74.03,138.04 89.07,138.04 89.07,57.15
DIR.B  (1 unrouted)
  Bottom 1: DRIVER.1.3 13.07,127.8 13.07,136.28 71.67,136.28 71.67,141.04 91.48,141.04 91.48,57.04
DIR.C
  Bottom 1: B1.39 108.98,54.2 108.98,43.84 111.28,41.54 145.18,41.54
  Bottom 1.016: 145.18,41.54 145.61,41.54 147.48,43.41 169.28,43.54 169.37,92.04 162.54,92.07 DRIVER.2.1
DIR.D
  Bottom 1: DRIVER.2.3 173.78,100.72 | 173.78,100.72 173.78,100.84 | 173.78,100.72 173.78,30.94 158.08,30.94 158.08,39.14 109.58,39.14 106.55,42.17 B1.37
GND  (via drill 0.35, 1)  (3 unrouted)
  Top 1.016: v148.41,79.59 148.41,85.94 v148.54,86.07 | v140.28,36.84 140.28,49.44 v140.18,49.54 | v55.68,129.24 v55.68,138.94
  Bottom 1: ENCODER.B.2 18.08,87 | ULN.2.8 86.22,38.74 86.08,38.74 86.08,38.34 86.68,38.44 107.18,38.44 109.18,36.64 | 192.89,77.39 192.89,77.24 192.38,77.24 192.38,77.39 ENCODER.D.2 183.08,77.39 183.08,85.34 188.08,85.34 188.08,95.96 ENCODER.C.2 | B1.GND@3 140.05,54.31 140.18,54.44 v140.18,49.54
  Bottom 1.016: U$1.GND 40.21,65.22 40.21,57.49 39.64,57.49 28.36,57.49 | 144.57,56.85 B1.GND@2 B1.GND@3 | B1.GND@4 85.01,124.16 79.99,129.18 GND1.1 GND1.2 67.51,128.16 | GND1.3 GND1.4 GND1.5 55.74,129.18 v55.68,129.24 | 14.84,111.04 14.84,121.2 DRIVER.1.5 16.75,122.72 16.88,122.84 16.75,122.97 14.65,122.97 14.18,123.44 8.28,123.44 | 14.84,111.04 14.84,110.22 14.18,109.56 14.18,89.88 17.09,86.96 ENCODER.B.2 21.14,86.96 22.84,85.26 22.94,61.82 23.47,61.09 | GND.5 GND.4 GND.3 | GND.3 155.06,129.26 | 155.06,128.38 155.06,129.26 | GND.3 154.71,129.65 155.06,129.65 155.06,129.26 | 155.06,129.26 GND.2 GND.1 | B1.GND B1.GND@1 | ENCODER.A.2 18.3,111.04 14.84,111.04 | ENCODER.C.2 178.48,95.96 178.48,105.8 171.43,105.8 | 8.28,138.94 v55.68,138.94 68.48,138.94 69.38,139.84 69.38,144.74 91.38,166.74 109.92,166.74 111.28,165.38 111.28,164.17 ULN.1.8 | 23.47,61.09 23.79,60.67 23.8,60.57 | 23.47,61.09 26.94,57.63 R1.1 | T2.3 150.13,76.48 v148.41,79.59 | v148.54,86.07 147.4,87.21 147.4,94.45 147.83,94.88 T1.3 151.73,98.29 159.23,105.8 DRIVER.2.5 | 109.18,36.64 140.08,36.64 v140.28,36.84 | 193.49,151.93 193.49,133.24
  Bottom 1.27: 188.22,139.91 24V1.2 | 188.57,137.01 192.79,132.78 192.79,131.78 | 171.43,105.8 DRIVER.2.5 158.4,109.95 158.4,110.19 B1.GND | ENCODER.C.2 184.39,95.84 | 30.03,57.75 30.03,57.61 R1.1 28.5,57.63 28.36,57.49 | R4.1 39.85,57.49 39.64,57.49 | 27.38,8.36 26.87,8.36 14.47,8.27 13.13,8.26 13.13,89.88 14.18,89.88 | 193.49,101.94 193.49,77.99 192.89,77.39 | U$2.1 145.98,129.26 GND.5 | GND1.3 GND1.2
  Bottom 2: 24V2.2 35.1,8.5 35.27,8.33
  Bottom 2.5: 12V1.2 53.79,8.26 35.27,8.33 27.38,8.36 | 27.38,8.36 24V4.2 27.28,8.76 26.87,8.36 | 24V1.2 188.57,138.01 188.57,137.01 192.33,133.24 | 192.33,133.24 193.49,133.24 193.49,130.97 | 192.33,133.24 193.49,134.41 | 193.49,130.97 161.5,130.97 GND.1 | 193.49,130.97 193.49,101.94 | 8.98,150.04 8.28,149.34 8.28,138.94 8.28,123.44 | 27.38,8.36 14.57,8.36 14.47,8.27
  Bottom 2.54: 24V5.2 13.15,150.04 8.98,150.04 8.98,164.64 9.85,165.52
GND2  (via drill 1 pad 1.3)  (1 unrouted)
  Top 1.016: v69.18,71.34 v69.18,64.54
  Bottom 1: U$1.GND1 52.84,70.3 53.18,70.64 59.28,64.54 v69.18,64.54 | R3.1 66.61,73.56 66.61,77.66 63.49,77.66
  Bottom 1.016: R3.1 69.15,71.37 v69.18,71.34
INT1.A
  Bottom 1: ENCODER.A.3 68.38,108.63 68.38,94.61 85.38,94.61 85.38,94.95 B1.3
INT1.B
  Bottom 1: ENCODER.B.3 20.81,84.42 | 42.71,59.67 42.71,75.38 | 42.71,75.38 42.71,75.77 | U$1.D3 42.71,75.38
  Bottom 1.016: 20.81,84.42 20.81,60.11 26.86,54.46 42.71,54.46 42.71,59.67
INT1.C
  Bottom 1: 156.38,13.82 156.28,22.94 181.01,22.74
  Bottom 1.016: B1.20 80.89,67.01 80.89,56.77 67.96,56.77 68.06,13.62 156.38,13.82 | 181.01,22.74 181.01,91.15 184.27,91.15 ENCODER.C.4
INT1.D  (1 unrouted)
  Bottom 1: 188.73,17.24 188.73,17.34 | 187.18,74.84 189.53,74.84 189.53,17.34 188.73,17.34 | 160.78,9.07 160.88,17.24 188.73,17.34
  Bottom 1.016: B1.18 83.39,72.09 | 83.39,72.09 76.07,72.09 76.07,62.28 61.47,62.28 61.37,9.17 160.78,9.07 | 83.39,72.09 83.39,72.1
INT2.A
  Bottom 1: B1.2 85.93,92.11 65.68,92.11 | 65.68,92.11 65.68,92.04 | 65.68,92.11 65.68,101.94 | 65.68,101.94 65.68,105.58 60.78,105.58 | 65.68,101.94 65.88,101.94 | 60.78,105.58 60.78,105.52 60.24,105.52 | 60.78,105.58 18.81,105.58 ENCODER.A.4
INT2.B
  Bottom 1: U$1.D2 45.41,72.84 | 45.41,72.84 45.41,72.87 | 45.41,72.84 45.41,58.13 45.41,57.67
  Bottom 1.016: 45.41,58.13 45.41,52.19 25.33,52.19 18.28,59.24 18.28,81.11 18.05,81.34 ENCODER.B.4
INT2.C
  Bottom 1: 178.67,25.24 154.28,25.44 154.18,16.01
  Bottom 1.016: B1.21 85.93,64.47 85.93,61.3 83.03,61.3 83.03,53.73 70.93,53.73 70.83,15.81 154.18,16.01 | 178.67,25.24 178.67,93.42 ENCODER.C.3
INT2.D
  Bottom 1: ENCODER.D.4 184.55,72.31 | 158.48,11.49 158.38,20.04 184.55,19.94
  Bottom 1.016: B1.19 78.31,69.56 78.31,59.57 64.85,59.57 64.95,11.39 157.38,11.49 158.48,11.49 | 184.55,19.94 184.55,72.31
L1  (1 unrouted)
  Bottom 3.5: F1.1 21.12,144.83 24V5.1
L2  (1 unrouted)
  Bottom 3.5: 24V1.1 167.84,144.91 F7.1
N$7  (1 unrouted)
N$8  (1 unrouted)
N$9
  Bottom 1: JP5.1 80.48,110.14 80.48,111.39 86.48,111.39 86.48,111.46 B1.9
N$10
  Bottom 1: B1.8 82.48,108.92 82.48,107.6 JP5.2
N$11
  Bottom 1: JP5.3 86.23,105.06 B1.7
N$12
  Bottom 1: JP5.4 86.23,102.52 B1.6
N$13
  Bottom 1: B1.5 72.48,100.03 | 72.48,100.03 72.48,100.04 | JP5.5 72.08,100.03 72.48,100.03
N$14
  Bottom 1: JP5.6 86.23,97.44 B1.4
N$16  (1 unrouted)
N$17
  Bottom 1.016: JP13.1 86.23,89.63 B1.1
N$18
  Bottom 1.016: B1.0 78.68,87.33 JP13.2
N$21  (1 unrouted)
N$22  (1 unrouted)
N$23
  Bottom 1.27: LED24V.K 29.45,44.74 29.85,44.34 29.85,47.27 R1.2
N$24
  Bottom 1: R4.2 53.09,57.83 57.49,53.43 LED12V.K
N$25
  Bottom 2.5: 26.71,22.45 26.71,30.73 22.59,30.73 19.28,34.04 19.28,48.14 F6.2
  Bottom 2.54: D1.A 26.71,22.45
N$26  (1 unrouted)
N$27  (1 unrouted)
N$28  (via drill 1 pad 1.3)
  other vias: 231.08,-52.16
N$29  (1 unrouted)
N$30  (1 unrouted)
N$31  (1 unrouted)
N$32  (1 unrouted)
N$33  (1 unrouted)
N$34  (1 unrouted)
N$35  (1 unrouted)
N$36  (1 unrouted)
N$37
  Bottom 1: JP7.2 114.19,56.85 B1.42
N$38
  Bottom 1: JP7.3 116.71,157.94 B1.44
N$39
  Bottom 1: JP7.4 119.37,157.84 119.37,61.74 119.25,61.74 B1.46
N$40
  Bottom 1: JP7.5 121.81,56.85 B1.48
N$41
  Bottom 1: JP7.6 124.35,56.85 B1.50
N$42  (1 unrouted)
  Bottom 1: JP7.7 126.89,57.04
N$44  (1 unrouted)
N$45  (1 unrouted)
N$46  (1 unrouted)
N$47
  Bottom 0.813: B1.A15 141.91,59.39 JP2.1
N$48
  Bottom 0.813: B1.A14 141.91,61.93 JP2.2
N$49
  Bottom 0.813: B1.A13 141.91,64.47 JP2.3
N$50
  Bottom 1: B1.A0 134.49,100.15
  Bottom 1.016: B1.A0 142.78,100.03 JP3.9
N$51
  Bottom 1: B1.A1 134.49,97.61
  Bottom 1.016: B1.A1 142.78,97.49 JP3.8
N$52
  Bottom 1.016: B1.A2 142.78,94.95 JP3.7
N$53
  Bottom 1.016: B1.A3 142.78,92.41 JP3.6
N$54
  Bottom 1.016: B1.A4 142.78,89.87 JP3.5
N$55
  Bottom 1.016: B1.A5 142.78,87.33 JP3.4
N$56
  Bottom 1.016: B1.A6 142.78,84.79 JP3.3
N$57
  Bottom 1: 134.49,82.04 B1.A7
  Bottom 1.016: B1.A7 142.78,82.25 JP3.2
N$58
  Bottom 0.813: B1.A8 136.86,79.55 JP3.1
N$59
  Bottom 0.813: B1.A12 141.91,67.01 JP2.4
N$60
  Bottom 0.813: B1.A11 141.91,69.55 JP2.5
N$61  (1 unrouted)
N$62  (1 unrouted)
N$63  (1 unrouted)
N$64  (1 unrouted)
N$65  (1 unrouted)
N$75
  Bottom 1: B1.41 111.63,46.83 JP6.7
N$76
  Bottom 1: B1.45 116.71,50.51 117.95,49.27 JP6.5
N$77
  Bottom 1: B1.43 114.17,48.93 115.41,47.69 JP6.6
N$78
  Bottom 1: B1.47 119.38,54.18 119.38,50.94 120.49,49.83 JP6.4
N$79
  Bottom 1: B1.49 121.79,51.53 123.03,50.29 JP6.3
N$80
  Bottom 1: B1.51 124.33,51.84 | 124.23,51.94 124.33,51.84 | 124.33,51.84 125.57,50.6 JP6.2
N$81
  Bottom 1.016: JP6.1 128.11,50.91 126.87,52.15 B1.53
N$102
  Bottom 1.016: R6.2 151.48,89.55 T1.1
N$103
  Bottom 1.016: T2.1 150.13,69.79 150.98,67.54 150.98,65.88 R7.2
N$107
  Bottom 1: U$1.D13 44.11,98.24 44.11,100.77 56.33,100.77 JP1.1
N$110
  Bottom 1: JP4.8 34.9,90.72 U$1.A0
N$111
  Bottom 1: JP4.7 34.9,88.18 U$1.A1
N$112
  Bottom 1: JP4.6 34.9,85.64 U$1.A2
N$113
  Bottom 1: U$1.A3 29.35,83 JP4.5
N$114
  Bottom 1: JP4.4 34.9,80.56 U$1.A4
N$115
  Bottom 1: U$1.A5 29.35,77.92 JP4.3
N$116
  Bottom 1: JP4.2 34.9,75.48 U$1.A6
N$117
  Bottom 1: JP4.1 34.9,72.94 U$1.A7
N$122
  Bottom 1: U$1.D12 50.14,98.06 JP1.2
N$123
  Bottom 1: U$1.D11 56.5,95.7 JP1.3
N$124
  Bottom 1: U$1.D10 56.5,93.16 JP1.4
N$125
  Bottom 1: U$1.D9 56.5,90.62 JP1.5
N$126
  Bottom 1: U$1.D8 56.5,88.08 JP1.6
N$127
  Bottom 1: JP1.7 56.5,85.54 U$1.D7
N$128
  Bottom 1: U$1.D6 50.14,82.82 JP1.8
N$135
  Bottom 1.016: JP9.1 53.38,65.22 U$1.RX1
N$136
  Bottom 1.016: U$1.TX0 50.34,62.48 51.84,62.48 54.85,59.47 56.51,59.47 JP9.2
N$152
  Bottom 2.5: 12V1.1 49.18,24.13 F3.1
PWM.A
  Bottom 1: DRIVER.1.2 16.36,130.26 29.58,130.26 29.58,125.38 80.91,125.38 84.67,121.62 B1.13
PWM.B
  Bottom 1: 25.56,122.69 80.72,122.69 84.32,119.08 B1.12
  Bottom 1.27: DRIVER.1.4 25.43,125.26 25.43,122.69 25.56,122.69
PWM.C  (via drill 1 pad 1.3)
  Top 1.016: v19.38,119.74 v8.88,119.74 | v171.45,14.57 v171.48,35.14
  Bottom 1.016: B1.11 60.48,116.54 58.98,118.04 58.98,119.74 v19.38,119.74 | v8.88,119.74 8.88,118.56 8.3,117.98 8.3,116.1 8.55,115.86 8.7,4.54 8.7,3.7 9.89,2.51 59.08,2.51 59.08,4.74 165.38,4.74 165.56,4.92 165.56,9.84 | 165.56,9.34 165.56,9.84 | DRIVER.2.2 166.64,98.18 171.48,97.94 v171.48,35.14 | 165.56,9.84 169.06,13.34 171.28,13.34 171.45,13.52 v171.45,14.57
PWM.D  (via drill 1 pad 1.3)
  Top 1.016: v17.58,117.04 v10.58,117.04 | v165.08,14.84 v165.08,27.94
  Bottom 1.016: 86.23,113.91 56.23,113.91 56.23,117.04 v17.58,117.04 17.48,117.04 | DRIVER.2.4 162.54,103.04 176.18,103.04 176.18,28.04 165.18,28.04 v165.08,27.94 | v10.58,117.04 10.73,4.54 56.48,4.54 56.48,6.94 135.47,6.84 163.11,6.87 163.31,7.07 163.31,14.27 165.04,14.88 v165.08,14.84
  Bottom 1.27: B1.10 86.23,113.91
RESET.MEGA
  Bottom 1.27: U$2.2 139.2,118.9 139.1,118.9 | 139.1,118.9 137.18,118.9 137.18,117.81 | 137.18,117.34 137.18,117.81 | 137.18,117.81 B1.RESET | R5.1 139.1,118.9
RX.BLUE
  Bottom 1: R2.1 73.56,87.85 69.15,87.85 R3.2 69.15,83.04 63.49,83.04 BLUETOOTH.2
RX.NANO
  Bottom 1: U$1.D5 57.86,80.46 57.86,73.06 61.88,69.04 71.52,69.04 71.52,77.17 B1.16
STATE  (1 unrouted)
TX.BLUE
  Bottom 1: BLUETOOTH.3 63.8,80.11 81.53,80.11 81.93,79.71 B1.15 86.48,79.71
TX.MEGA
  Bottom 1: R2.2 86.18,82.3 B1.14
TX.NANO
  Bottom 1: U$1.D4 50.11,77.92 50.11,77.79 55.44,77.79 55.44,72.58 61.34,66.68 73.82,66.68 73.82,74.44 86.23,74.44 B1.17